# Altium schematic sheet Power.SchDoc
size Letter
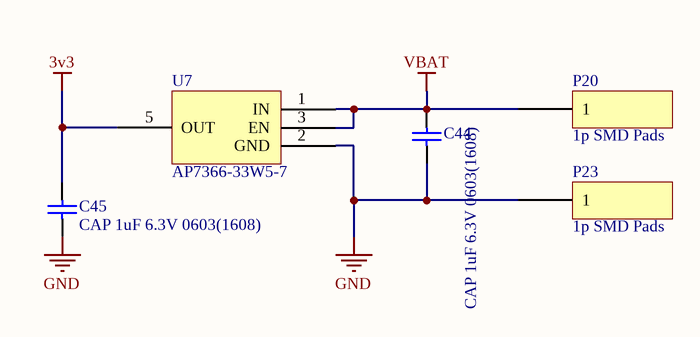
[diagram p0: Power.SchDoc]

## Parts
C44  CAP 1uF 6.3V 0603(1608)  [CAPC0603(1608)100_L]
C45  CAP 1uF 6.3V 0603(1608)  [CAPC0603(1608)100_L]
P20  1p SMD Pads  [1p SMD pad]
P23  1p SMD Pads  [1p SMD pad]
U7  AP7366-33W5-7  [SOT95P280X145-5N]

## Nets
3v3: C45.2 U7.5(OUT)
GND: C44.1 C45.1 P23.1 U7.2(GND)
VBAT: C44.2 P20.1 U7.1(IN) U7.3(EN)

## Notes on the sheet
- Title
- Size:
- Date:
- Letter
- Number:
- Time:
- Revision:
- Sheet
- of
- Copyright 2019
- Specialized Solutions LLC
- 206 W Lincoln Hwy STE B
- New Haven, IN 46774
- www.specsolns.com <http://www.specsolns.com>
- File:

## Library data of the parts
C44 C45 = CMP-1035-02731-1: CAP 1uF 6.3V ±20% 0603 (1608 Metric) Thickness 1mm SMD; Case-EIA: 0603; Tolerance: Â±20%; Case-Metric: 1608; Value: 1uF; Technology: SMT; Max Thickness: 1 mm; Rated Voltage: 6.3 V
P20 P23 = 1p SMD
U7 = AP7366-33W5-7: Linear Voltage Regulator IC 1 Output 600mA SOT-25